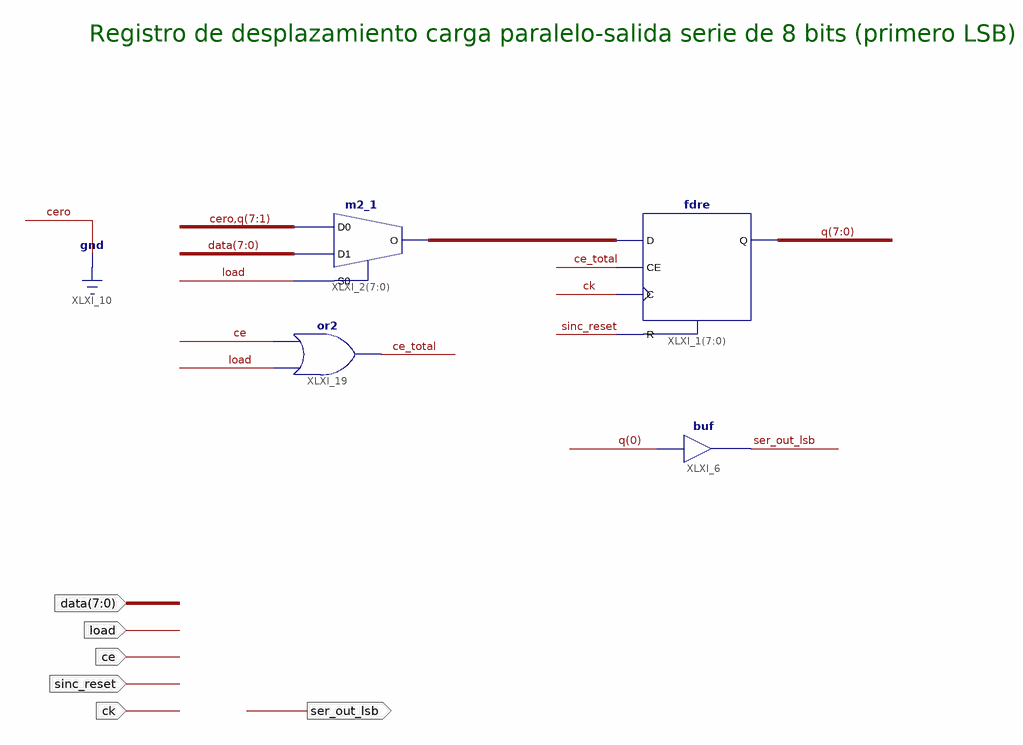
[diagram p0: schematic sheet 1]
// Xilinx ISE schematic regdesp8b_lsb.sch (spartan6) as structural Verilog: 4 symbols, 6 ports
module regdesp8b_lsb (
  input  ck,
  input  ce,
  input  sinc_reset,
  input  load,
  input  [7:0] data,
  output ser_out_lsb
);

  wire ce_total;
  wire [7:0] q, XLXN_26;

  m2_1 XLXI_2[7:0] (.D0({1'b0, q[7:1]}), .D1(data), .S0(load), .O(XLXN_26));
  fdre XLXI_1[7:0] (.C(ck), .CE(ce_total), .D(XLXN_26), .R(sinc_reset), .Q(q));
  buf XLXI_6 (ser_out_lsb, q[0]);
  or XLXI_19 (ce_total, load, ce);

  // Notes on the sheet:
  //   Registro de desplazamiento carga paralelo-salida serie de 8 bits (primero LSB)
endmodule
